# Altium schematic sheet P15 Hi3519 Config.SchDoc
size 420 x 297 mm
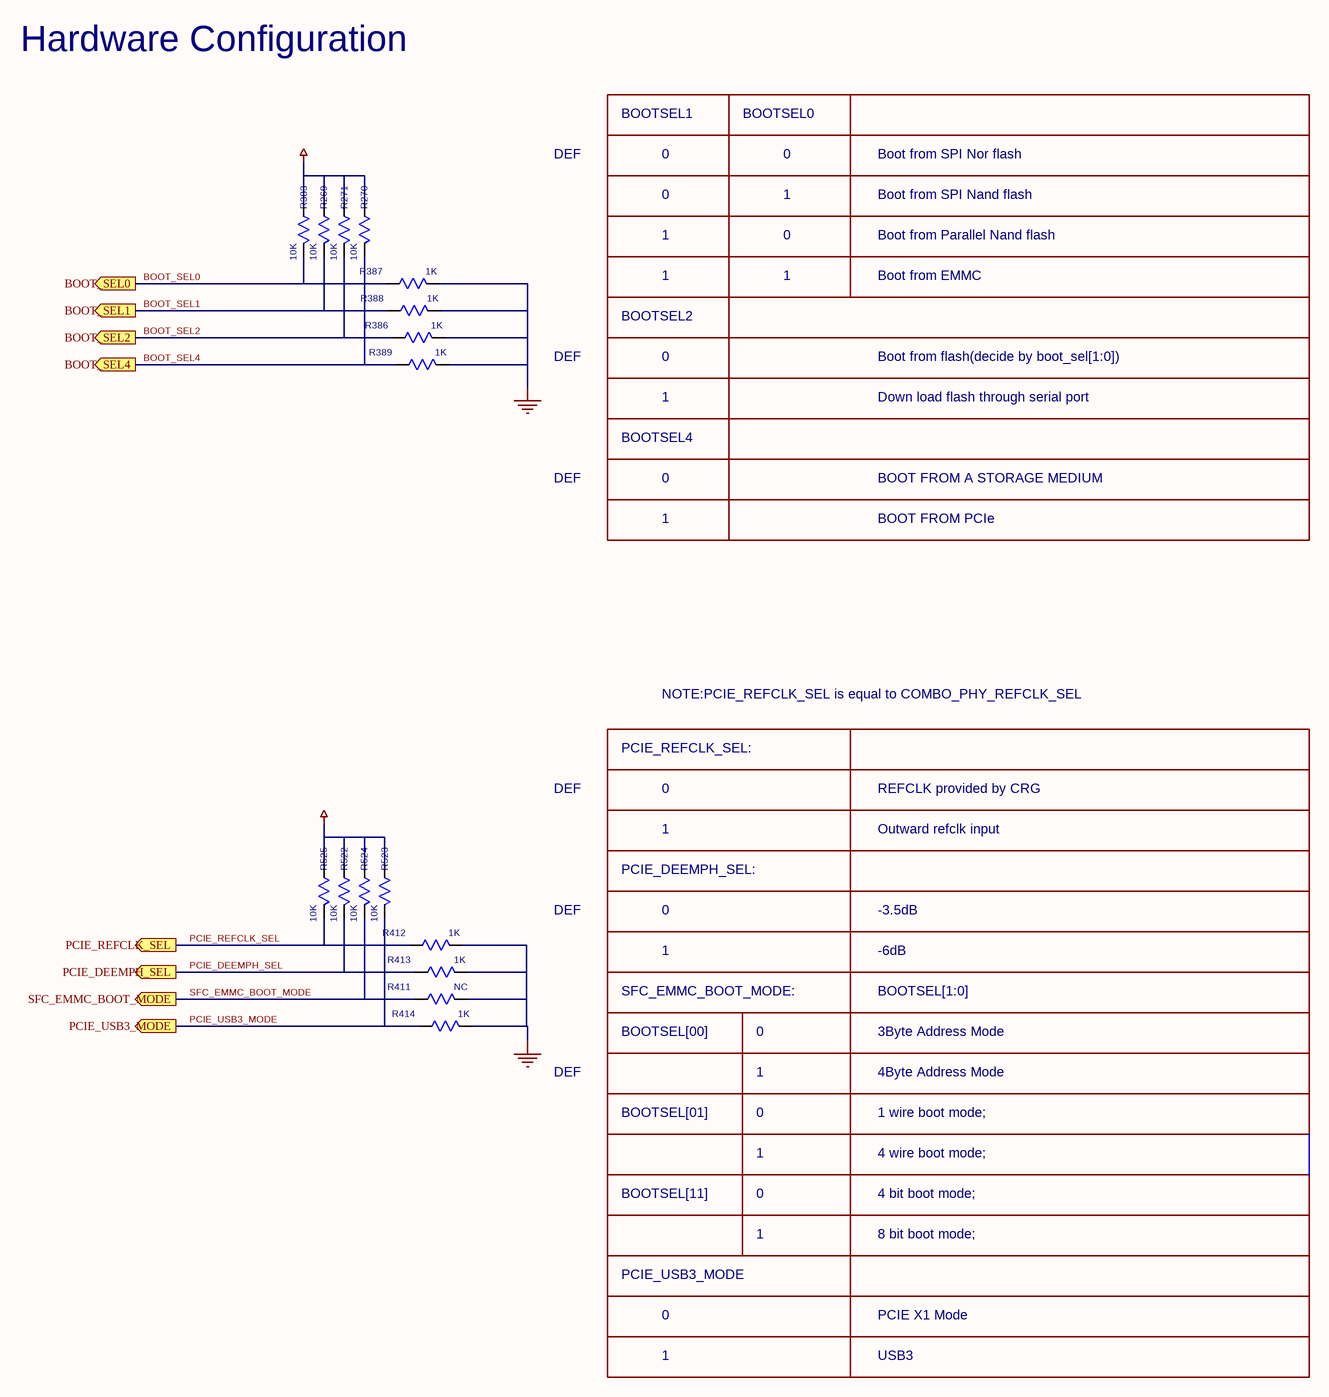
[diagram p0: P15 Hi3519 Config.SchDoc]

## Parts
R269  10K  [SR0402]
R270  10K  [SR0402]
R271  10K  [SR0402]
R383  10K  [SR0402]
R386  1K  [SR0402]
R387  1K  [SR0402]
R388  1K  [SR0402]
R389  1K  [SR0402]
R411  NC  [SR0402]
R412  1K  [SR0402]
R413  1K  [SR0402]
R414  1K  [SR0402]
R522  10K  [SR0402]
R523  10K  [SR0402]
R524  10K  [SR0402]
R525  10K  [SR0402]

## Ports
BOOT_SEL0, BOOT_SEL1, BOOT_SEL2, BOOT_SEL4, PCIE_DEEMPH_SEL, PCIE_REFCLK_SEL, PCIE_USB3_MODE, SFC_EMMC_BOOT_MODE

## Nets
1V8: R269.1(A) R270.1(A) R271.1(A) R383.1(A) R522.1(A) R523.1(A) R524.1(A) R525.1(A)
GND: R386.2(B) R387.2(B) R388.2(B) R389.2(B) R411.2(B) R412.2(B) R413.2(B) R414.2(B)
BOOT_SEL0: R383.2(B) R387.1(A) ; port BOOT_SEL0
BOOT_SEL1: R269.2(B) R388.1(A) ; port BOOT_SEL1
BOOT_SEL2: R271.2(B) R386.1(A) ; port BOOT_SEL2
BOOT_SEL4: R270.2(B) R389.1(A) ; port BOOT_SEL4
PCIE_DEEMPH_SEL: R413.1(A) R522.2(B) ; port PCIE_DEEMPH_SEL
PCIE_REFCLK_SEL: R412.1(A) R525.2(B) ; port PCIE_REFCLK_SEL
PCIE_USB3_MODE: R414.1(A) R523.2(B) ; port PCIE_USB3_MODE
SFC_EMMC_BOOT_MODE: R411.1(A) R524.2(B) ; port SFC_EMMC_BOOT_MODE

## Notes on the sheet
- Hardware Configuration
- DEF
- BOOTSEL1
- 0
- BOOTSEL0
- Boot from SPI Nor flash
- 1
- Boot from SPI Nand flash
- Boot from Parallel Nand flash
- Boot from EMMC
- BOOTSEL2
- Boot from flash(decide by boot_sel[1:0])
- Down load flash through serial port
- BOOTSEL4
- BOOT FROM A STORAGE MEDIUM
- BOOT FROM PCIe
- NOTE:PCIE_REFCLK_SEL is equal to COMBO_PHY_REFCLK_SEL
- PCIE_REFCLK_SEL:
- REFCLK provided by CRG
- Outward refclk input
- PCIE_DEEMPH_SEL:
- -3.5dB
- -6dB
- SFC_EMMC_BOOT_MODE:
- BOOTSEL[00]
- 3Byte Address Mode
- BOOTSEL[1:0]
- 4Byte Address Mode
- BOOTSEL[01]
- 4 wire boot mode;
- 1 wire boot mode;
- BOOTSEL[11]
- 4 bit boot mode;
- 8 bit boot mode;
- PCIE_USB3_MODE
- PCIE X1 Mode
- USB3

## Library data of the parts
R269-R271 R383 R522-R525 = R_Dup1: PARTS: 1; OriginalSymbolOrigin: (0,0); PINSWAP: (A,B); DEVICE: RK73H1ETTP1002F; LEVEL: STD; %208%%161%%192%%224%%195%%251%%179%%198%: 片式厚膜电阻器; %195%%232%%202%%246%: 片式厚膜电阻器-0.0625W-10000ohm-+/-1%-0402-BT; CODE: 7090867; COMPONENT_HIGH_MAX: 100000000MM; PKG_TYPE: SR0402
R386 R387 R389 R412 R413 = R_Dup1: PARTS: 1; OriginalSymbolOrigin: (0,0); PINSWAP: (A,B); DEVICE: RC0402FR_071KL; LEVEL: STD; COMPONENT_HIGH_MAX: 0.4MM; CODE: 7091282; %195%%232%%202%%246%: 片式厚膜电阻器-0.0625W-1000ohm-+/-1%-0402-BT; %208%%161%%192%%224%%195%%251%%179%%198%: 片式厚膜电阻器; PKG_TYPE: SR0402
R388 R411 R414 = R_Dup1: PARTS: 1; OriginalSymbolOrigin: (0,0); PINSWAP: (A,B); DEVICE: RC0402FR_071KL; LEVEL: STD; %208%%161%%192%%224%%195%%251%%179%%198%: 片式厚膜电阻器; %195%%232%%202%%246%: 片式厚膜电阻器-0.0625W-1000ohm-+/-1%-0402-BT; CODE: 7091282; COMPONENT_HIGH_MAX: 0.4MM; PKG_TYPE: SR0402